# EAGLE schematic TSAL (EAGLE 9.6.2)
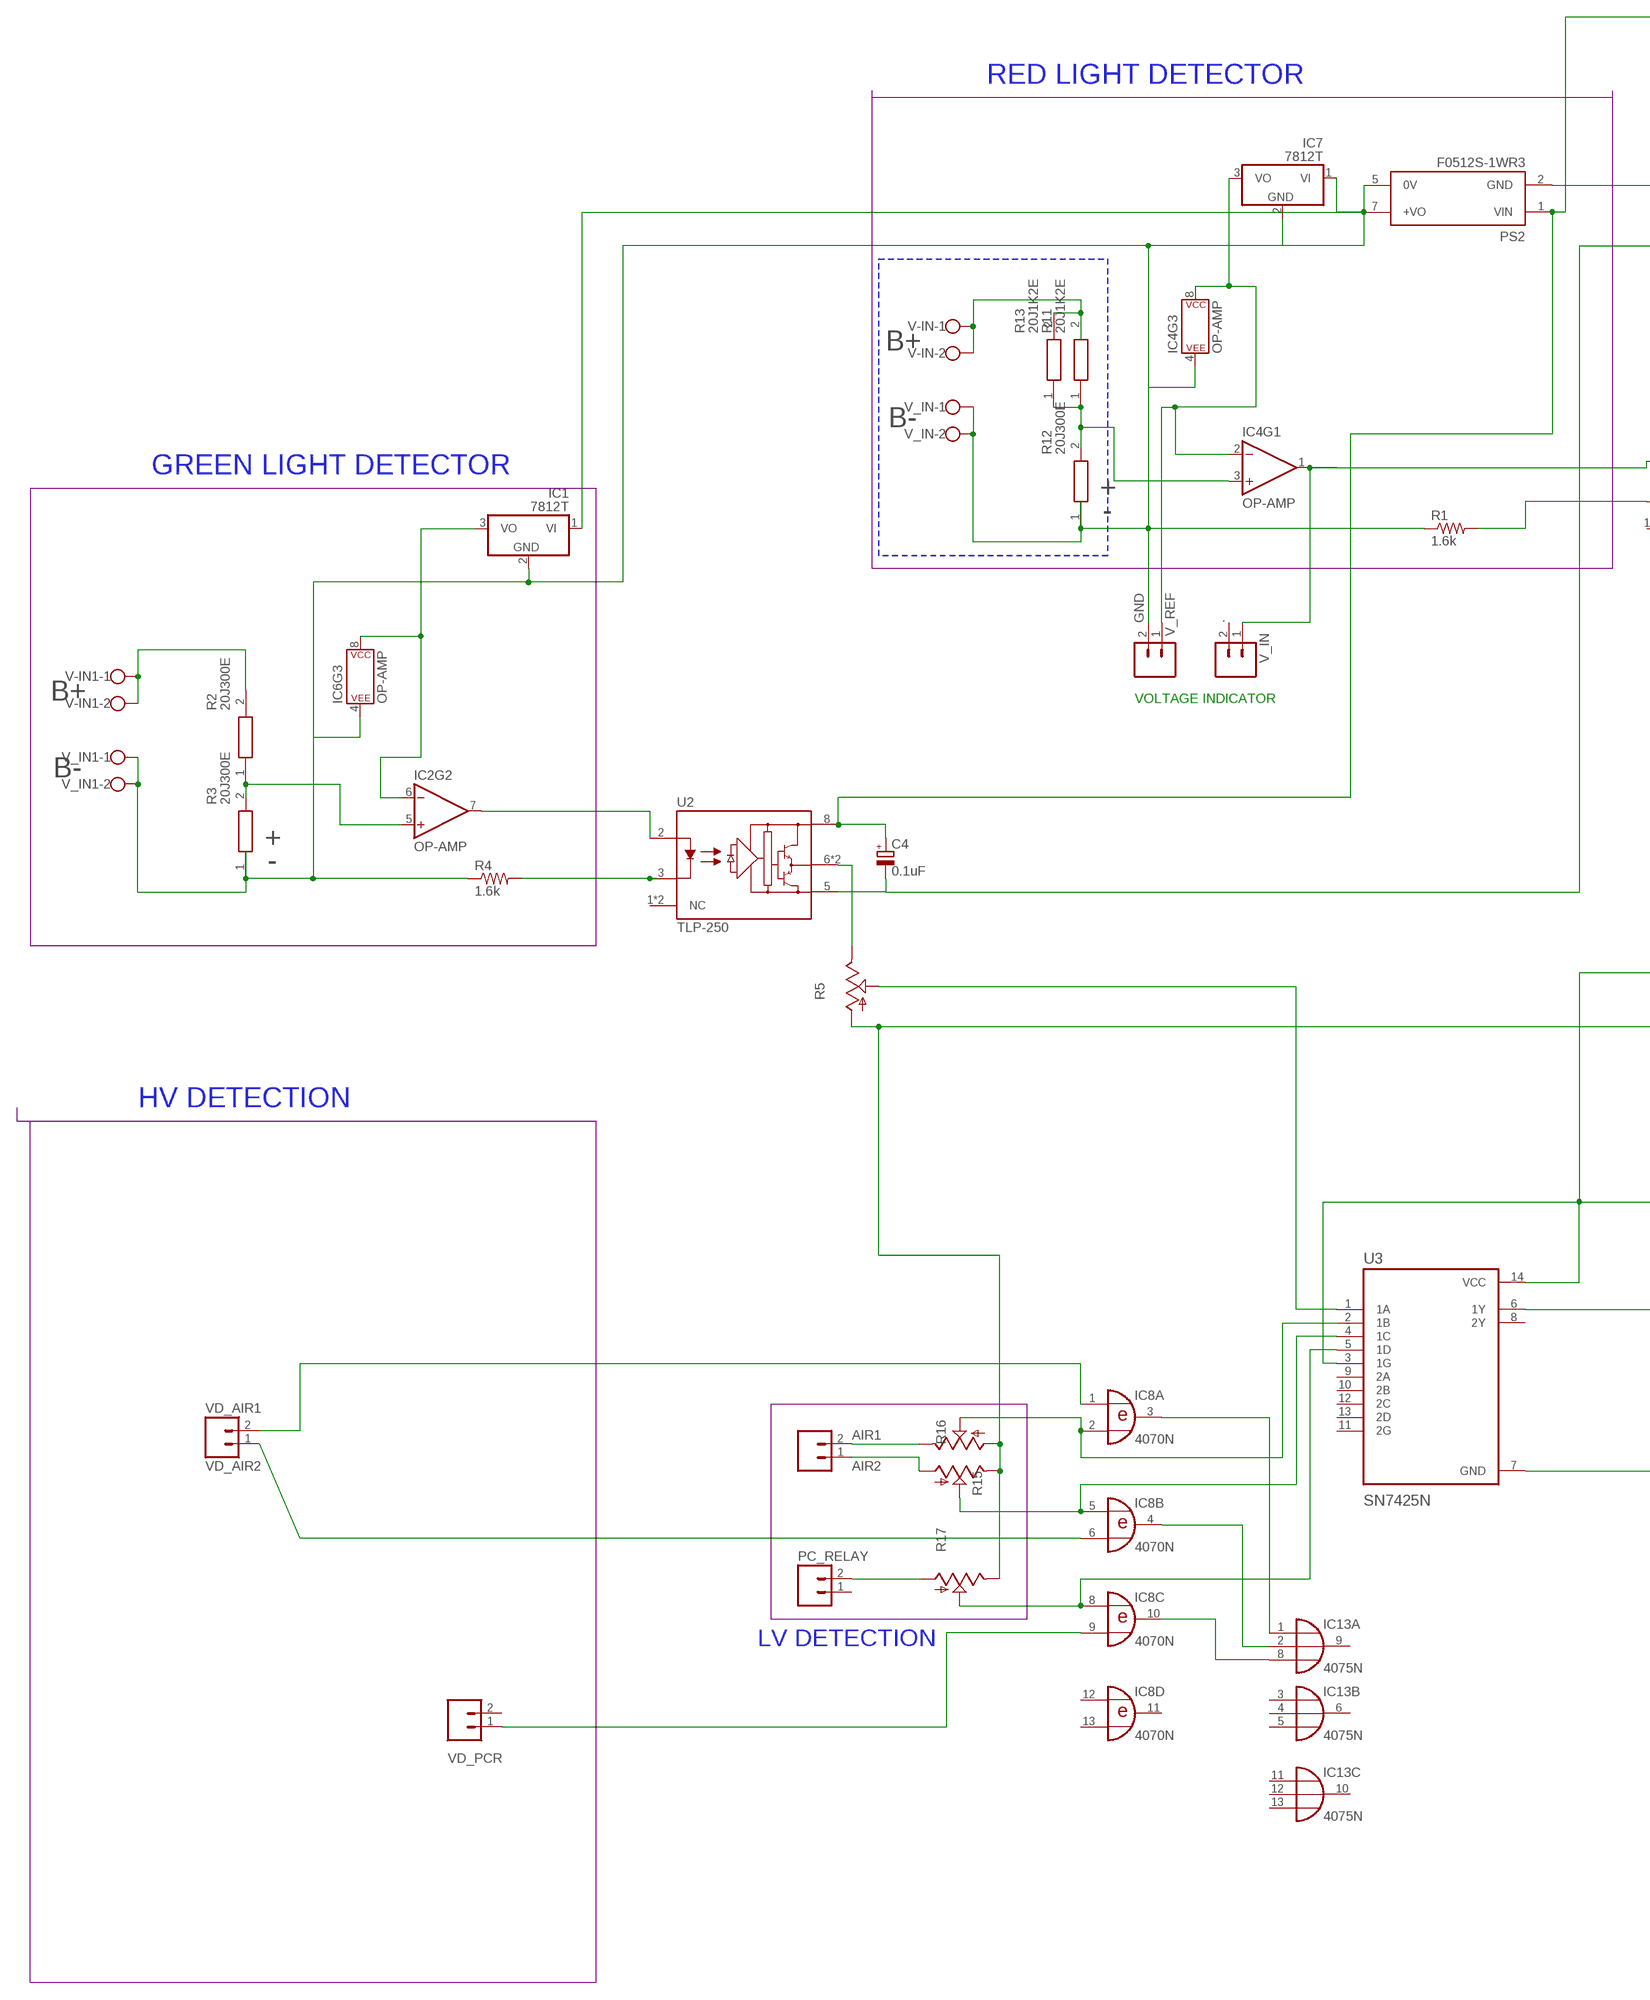
[diagram p0: schematic, sheet 1, part 1 of 2]
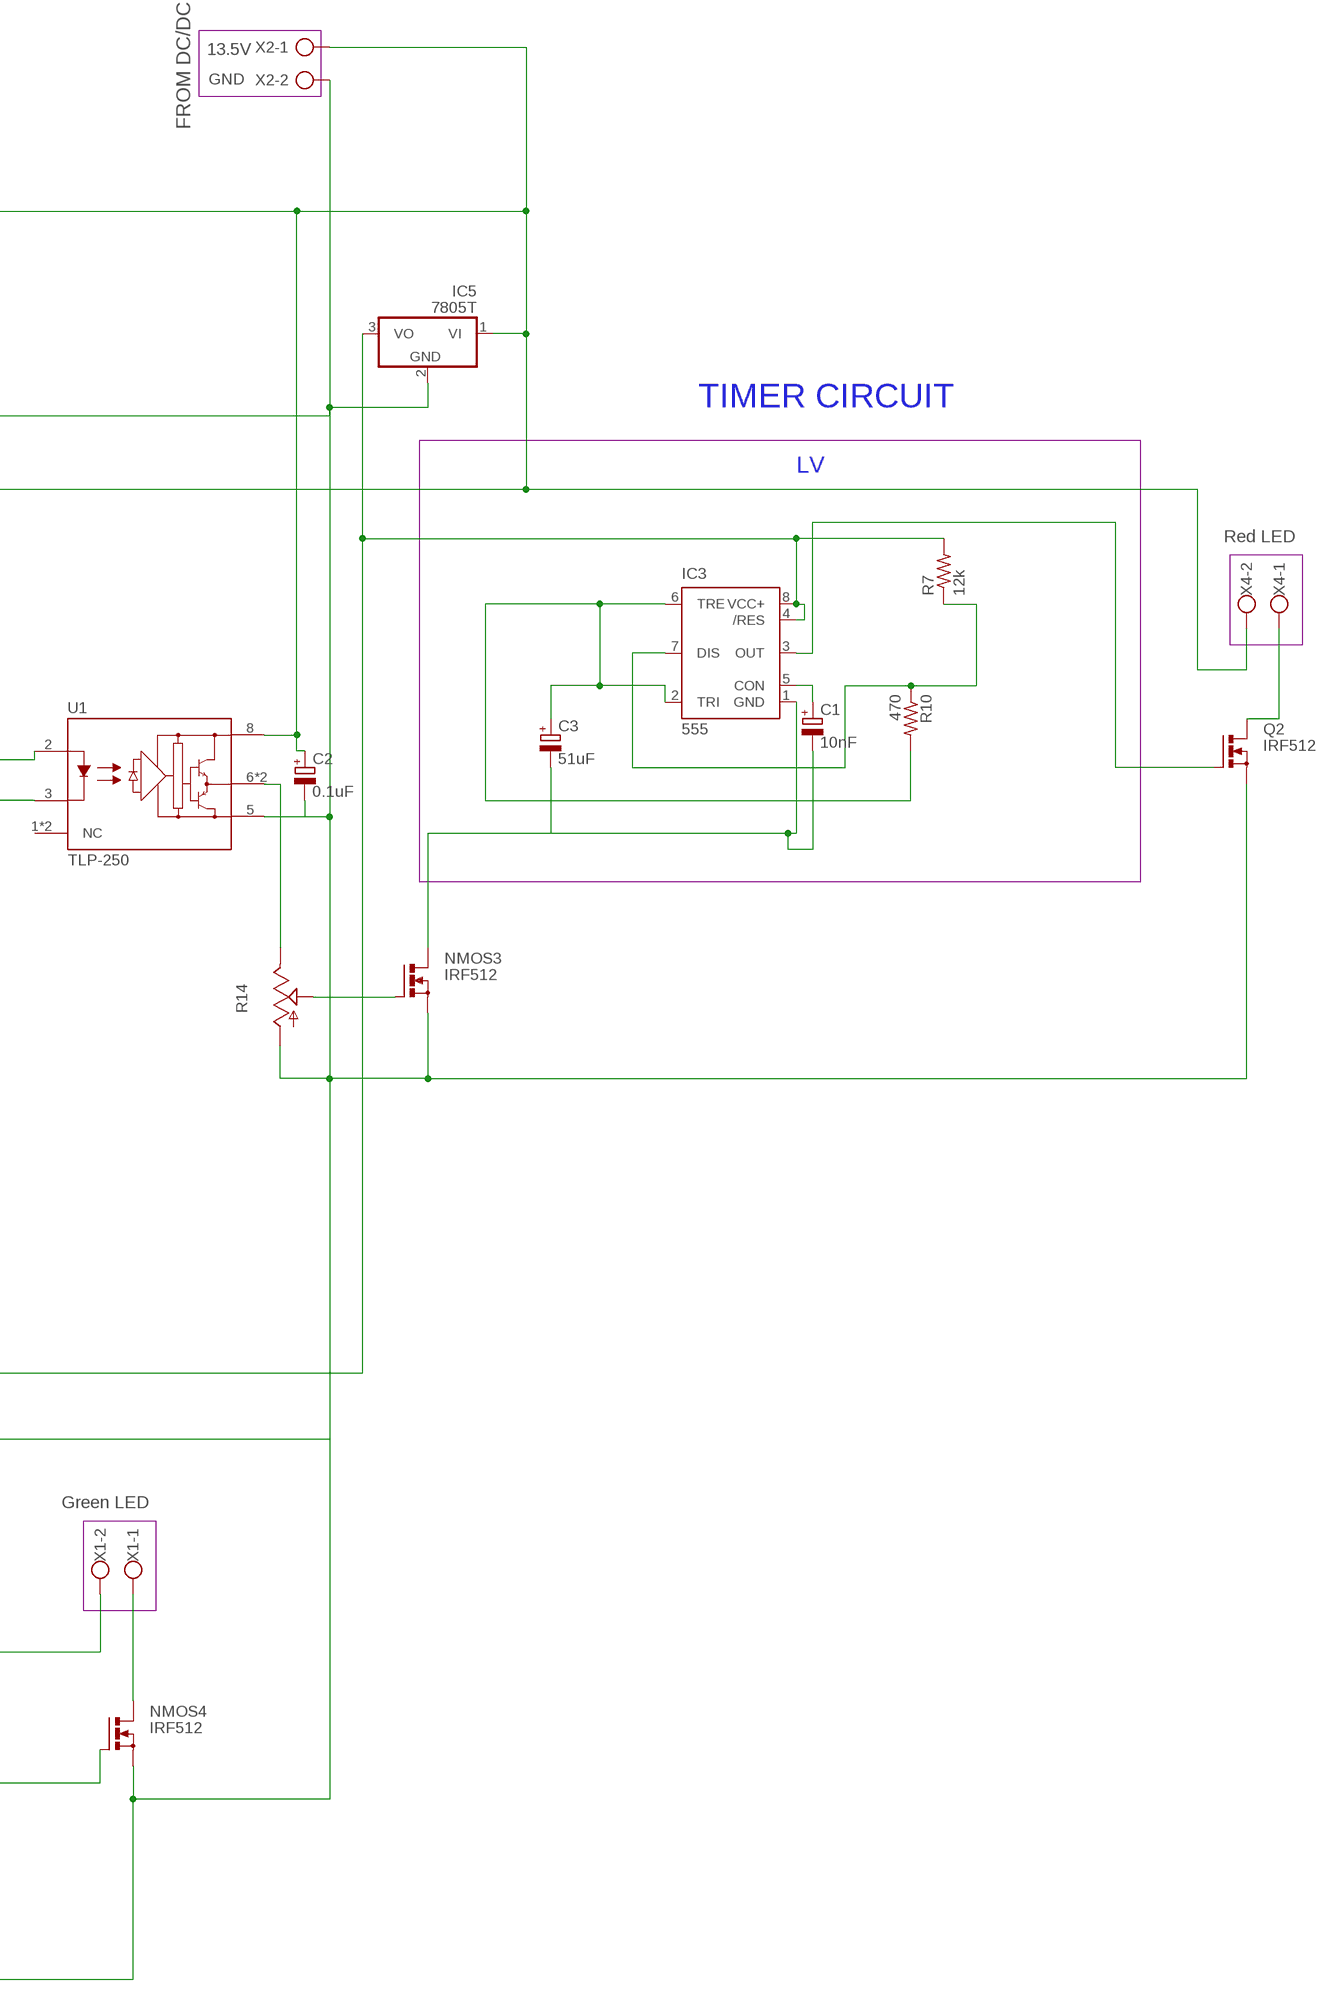
[diagram p1: schematic, sheet 1, part 2 of 2]

## Parts
.  V_IN  M02  [02P]
AIR1  AIR2  M02  [02P]
C1  10nF  CPOL-EUE2-5  [E2-5]
C2  0.1uF  CPOL-EUE2-5  [E2-5]
C3  51uF  CPOL-EUE2-5  [E2-5]
C4  0.1uF  CPOL-EUE2-5  [E2-5]
GND  V_REF  M02  [02P]
IC1  7812T  [TO220H]
IC2  OP-AMP  OPAMP-DUALDIP  [DIP08]
IC3  555  555P  [DIP08]
IC4  OP-AMP  OPAMP-DUALDIP  [DIP08]
IC5  7805T  [TO220H]
IC6  OP-AMP  OPAMP-DUALDIP  [DIP08]
IC7  7812T  [TO220H]
IC8  4070N  [DIL14]
IC13  4075N  [DIL14]
NMOS3  IRF512  [TO220BV]
NMOS4  IRF512  [TO220BV]
PC_RELAY  M02  [02P]
PS2  F0512S-1WR3  [CONV_F0512S-1WR3]
Q2  IRF512  [TO220BV]
R1  1.6k  R-US_0204/5  [0204/5]
R2  20J300E  [RESAD8720W81L4720D1000]
R3  20J300E  [RESAD8720W81L4720D1000]
R4  1.6k  R-US_0204/5  [0204/5]
R5  TRIM_US-B25P  [B25P]
R7  12k  R-US_0204/5  [0204/5]
R10  470  R-US_0204/5  [0204/5]
R11  20J1K2E  [RESAD8720W81L4720D1000]
R12  20J300E  [RESAD8720W81L4720D1000]
R13  20J1K2E  [RESAD8720W81L4720D1000]
R14  TRIM_US-B25P  [B25P]
R15  TRIM_US-B25P  [B25P]
R16  TRIM_US-B25P  [B25P]
R17  TRIM_US-B25P  [B25P]
U1  TLP-250  [DIP762W50P254L966H485Q8]
U2  TLP-250  [DIP762W50P254L966H485Q8]
U3  SN7425N  [DIP794W45P254L1969H508Q14]
V-IN  W237-102  [W237-102]
V-IN1  W237-102  [W237-102]
V_IN  W237-102  [W237-102]
V_IN1  W237-102  [W237-102]
VD_AIR1  VD_AIR2  M02  [02P]
VD_PCR  M02  [02P]
X1  W237-102  [W237-102]
X2  W237-102  [W237-102]
X4  W237-102  [W237-102]

## Nets
13.5V1: IC3.4(/RES) IC3.8(VCC+) IC5.3(VO) R7.2 U3.3(1G) U3.14(VCC) X1.2
N$1: C1.+ IC3.5(CON)
N$2: IC1.1(VI) IC7.1(VI) PS2.7(+VO)
N$3: R1.2 U1.3(CATHODE)
N$4: ..1 IC4.1(OUT) U1.2(ANODE)
N$5: R4.2 U2.3(CATHODE)
N$6: IC8.9(C:I1) VD_PCR.1
N$7: R2.2 V-IN1.1 V-IN1.2
N$8: IC2.5(+IN) R2.1 R3.2
N$9: IC8.3(A:O) IC13.1(A:I0)
N$10: IC1.3(VO) IC2.6(-IN) IC6.8(P$V+)
N$11: R14.E U1.6(VO) U1.7(VO)
N$12: IC2.7(OUT) U2.2(ANODE)
N$13: GND.2 IC1.2(GND) IC4.4(P$V-) IC6.4(P$V-) IC7.2(GND) PS2.5(0V) R1.1 R3.1 R4.1 R12.1 V_IN1.1 V_IN1.2 V_IN.1 V_IN.2
N$14: R5.S U3.1(1A)
N$15: C2.+ C4.+ C4.- IC5.1(VI) PS2.1(VIN) U1.8(VCC) U2.5(GND) U2.8(VCC) X2.1 X4.2
N$16: R5.E U2.6(VO) U2.7(VO)
N$18: IC3.3(OUT) Q2.G
N$19: IC3.7(DIS) R7.1 R10.1
N$20: C3.+ IC3.2(TRI) IC3.6(TRE) R10.2
N$21: Q2.D X4.1
N$22: NMOS4.G U3.6(1Y)
N$23: C1.- C3.- IC3.1(GND) NMOS3.D
N$24: R11.2 R13.2 V-IN.1 V-IN.2
N$25: IC4.3(+IN) R11.1 R12.2 R13.1
N$26: IC8.2(A:I1) R15.S U3.2(1B)
N$27: IC8.4(B:O) IC13.2(A:I1)
N$28: GND.1 IC4.2(-IN) IC4.8(P$V+) IC7.3(VO)
N$29: IC8.10(C:O) IC13.8(A:I2)
N$30: IC8.8(C:I0) R17.S U3.5(1D)
N$31: NMOS3.G R14.S
N$33: AIR1.2 R15.E
N$36: NMOS4.D X1.1
N$37: IC8.1(A:I0) VD_AIR1.2
N$39: PC_RELAY.2 R17.A
N$40: IC8.6(B:I1) VD_AIR1.1
N$43: AIR1.1 R16.A
N$44: IC8.5(B:I0) R16.S U3.4(1C)
N$45: C2.- IC5.2(GND) NMOS3.S NMOS4.S PS2.2(GND) Q2.S R5.A R14.A R15.A R16.E R17.E U1.5(GND) U3.7(GND) X2.2
Unconnected: ..2 IC2.1(OUT) IC2.2(-IN) IC2.3(+IN) IC2.4(P$V-) IC2.8(P$V+) IC4.5(+IN) IC4.6(-IN) IC4.7(OUT) IC6.1(OUT) IC6.2(-IN) IC6.3(+IN) IC6.5(+IN) IC6.6(-IN) IC6.7(OUT) IC8.11(D:O) IC8.12(D:I0) IC8.13(D:I1) IC13.3(B:I0) IC13.4(B:I1) IC13.5(B:I2) IC13.6(B:O) IC13.9(A:O) IC13.10(C:O) IC13.11(C:I0) IC13.12(C:I1) IC13.13(C:I2) PC_RELAY.1 U1.1(NC) U1.4(NC) U2.1(NC) U2.4(NC) U3.8(2Y) U3.9(2A) U3.10(2B) U3.11(2G) U3.12(2C) U3.13(2D) VD_PCR.2

## Notes on the sheet
- 13.5V
- GND
- FROM DC/DC
- RED LIGHT DETECTOR
- TIMER CIRCUIT
- LV
- Red LED
- B+
- B-
- GREEN LIGHT DETECTOR
- +
- -
- B+ | VOLTAGE INDICATOR
- B-
- +
- -
- Green LED
- HV DETECTION
- LV DETECTION

## Power pins joined to a net without a drawn wire
VDD: IC8.14(P:VDD) IC13.14(P:VDD)
VSS: IC8.7(P:VSS) IC13.7(P:VSS)

## Library data of the parts
. AIR1 GND PC_RELAY VD_AIR1 VD_PCR = con-amp-quick:M02: AMP QUICK CONNECTOR; OC_FARNELL: unknown; OC_NEWARK: unknown
C1-C4 = rcl:CPOL-EU: POLARIZED CAPACITOR, European symbol; SPICEPREFIX: C
IC1 IC5 IC7 = linear:78*: Positive VOLTAGE REGULATOR Source: http://cache.national.com/ds/LM/LM78L05.pdf http://www.fairchildsemi.com/ds/LM/LM7805.pdf
IC2 IC4 IC6 = SparkFun-IC-Amplifiers:OPAMP-DUAL: Generic op-amp footprint This component is for the standard 358 pinning of a dual op-amp From the LM358 datasheet: Pin 1: Output A Pin 2: Inverting Input A Pin 3: Non-Inverting Input A Pin 4: Gnd Pin 5: Non-Inverting Input B Pin 6: Inverting Input B Pin 7: Output B Pin 8: V+; PROD_ID: NA-XXXXX
IC3 = SparkFun-IC-Special-Function:555: General purpose bipolar Timer Datasheet <http://www.sparkfun.com/datasheets/Components/General/ne555.pdf> SparkFun Products SparkFun SparkPunk Sequencer Kit <https://www.sparkfun.com/products/12707> (KIT-12707) Storefront Component: 555 Timer <https://www.sparkfun.com/products/9273> (COM-09273) Two parts valid for production: VFP: IC-11930 (M7555 PTH) VFP: IC-09173 (555 PTH) - Preferred; PROD_ID: IC-09173; PROD_ID_ALT: IC-09173
IC8 = 40xx:4070: Quad 2-input XOR
IC13 = 40xx:4075: Triple 3-input OR
NMOS3 NMOS4 Q2 = transistor-power:IRF512: N-CHANNEL MOS FET
PS2 = F0512S-1WR3:F0512S-1WR3: DC/DC Converter Check availability <https://pricing.snapeda.com/parts/F0512S-1WR3/MORNSUN/view-part?ref=eda>; AVAILABILITY: In Stock; DESCRIPTION: Isolated Module DC DC Converter 1 Output 12V - - - 84mA 4.5V - 5.5V Input; MF: MORNSUN; MP: F0512S-1WR3; PACKAGE: SIP-4-4 MORNSUN; PRICE: None; PURCHASE-URL: https://pricing.snapeda.com/search/part/F0512S-1WR3/?ref=eda
R1 R4 R7 R10 = rcl:R-US_: RESISTOR, American symbol; SPICEPREFIX: R
R2 R3 R12 = 20J300E:20J300E: Ohmite 20 Series ceramic Axial Wirewound Resistor 300 +/-5% 10W +/-30ppm/C Source: Datasheet <https://www.mouser.in/datasheet/2/303/res_20-1228661.pdf>; DESCRIPTION: Ohmite 20 Series ceramic Axial Wirewound Resistor 300 +/-5% 10W +/-30ppm/C; HEIGHT: mm; MANUFACTURER_NAME: Ohmite; MANUFACTURER_PART_NUMBER: 20J300E
R5 R14-R17 = pot:TRIM_US-: POTENTIOMETER
R11 R13 = 20J1K2E:20J1K2E: Ohmite 20 Series ceramic Axial Wirewound Resistor 1.2k +/-5% 10W +/-30ppm/C Source: Datasheet <https://www.mouser.in/datasheet/2/303/res_20-1228661.pdf>; DESCRIPTION: Ohmite 20 Series ceramic Axial Wirewound Resistor 1.2k +/-5% 10W +/-30ppm/C; HEIGHT: mm; MANUFACTURER_NAME: Ohmite; MANUFACTURER_PART_NUMBER: 20J1K2E
U1 U2 = TLP-250:TLP-250: Check availability <https://pricing.snapeda.com/parts/TLP250/Toshiba%20Semiconductor/view-part?ref=eda>; AVAILABILITY: In Stock; DESCRIPTION: Logic Output Optoisolator - Push-Pull, Totem Pole 3750Vrms 1 Channel 40kV/µs CMTI 8-SMD; MF: Toshiba Semiconductor; MP: TLP250; PACKAGE: DIP-8 Toshiba; PRICE: None; PURCHASE-URL: https://pricing.snapeda.com/search/part/TLP250/?ref=eda
U3 = SN7425N:SN7425N: Check availability <https://pricing.snapeda.com/parts/SN7425N/Texas%20Instruments/view-part?ref=eda>; AVAILABILITY: In Stock; DESCRIPTION: 2-ch, 4-input, 4.75-V to 5.25-V bipolar NOR gates; MF: Texas Instruments; MP: SN7425N; PACKAGE: PDIP-14 Texas Instruments; PRICE: None; PURCHASE-URL: https://pricing.snapeda.com/search/part/SN7425N/?ref=eda
V-IN V-IN1 V_IN V_IN1 X1 X2 X4 = con-wago-500:W237-102: WAGO SCREW CLAMP; MPN: 237-102; OC_FARNELL: unknown; OC_NEWARK: 70K9898